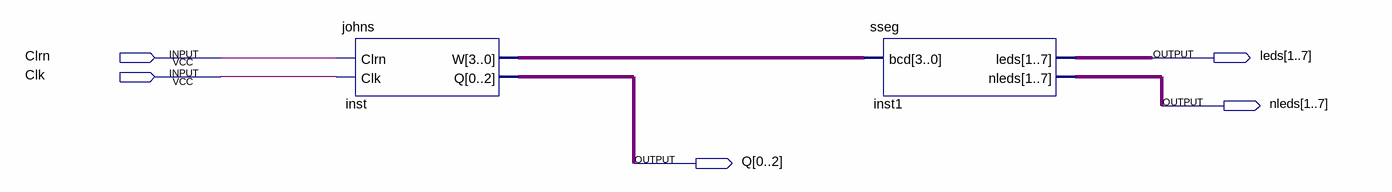
[diagram p0: schematic sheet]
// Quartus schematic jOHNSON2.bdf as structural Verilog: 2 symbols, 5 pins
module jOHNSON2 (
  input  Clrn,
  input  Clk,
  output [1:7] leds,
  output [1:7] nleds,
  output [0:2] Q
);

  wire [3:0] inst_w;

  johns inst (.Clrn(Clrn), .Clk(Clk), .W(inst_w), .Q(Q));
  sseg inst1 (.bcd(inst_w), .leds(leds), .nleds(nleds));
endmodule
